# EasyEDA schematic EasyEDA.json
TITLE: KeyThing; REV: 1.0; Date: 2023-04-28; Sheet: 1/1; Drawn By: Greg; Company: COMPAN~1
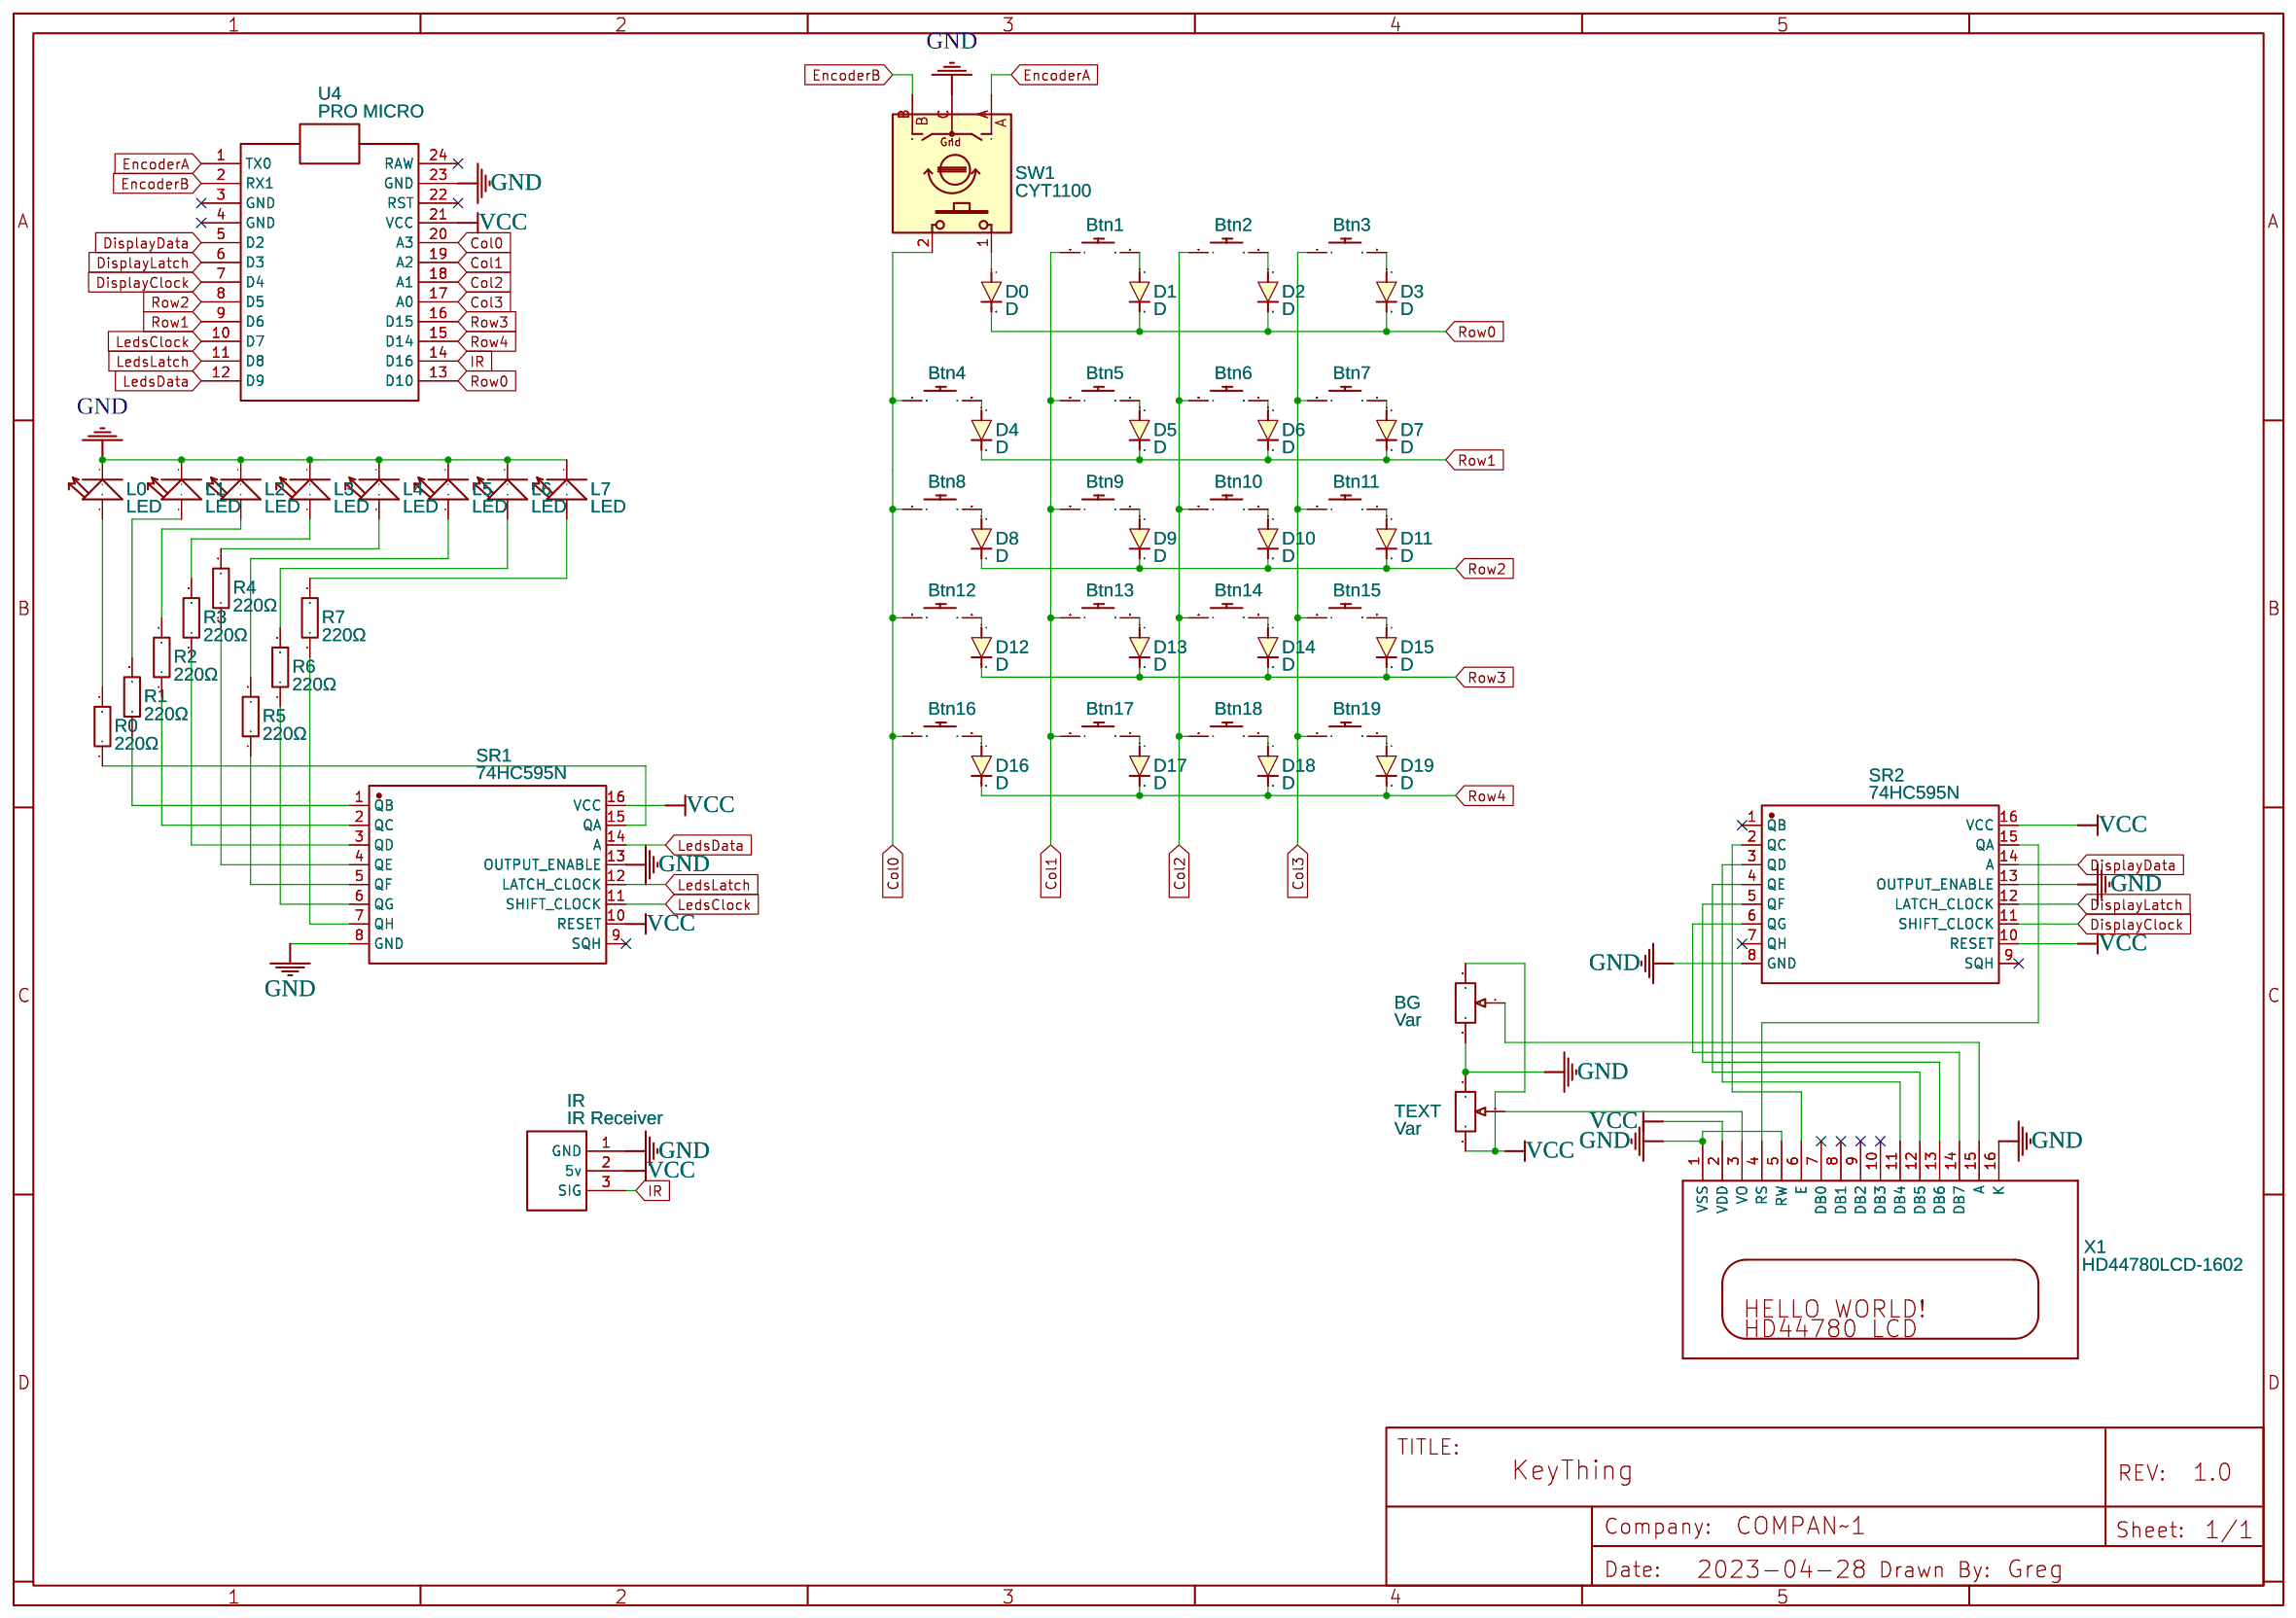
[diagram p0: schematic sheet]

## Parts
B1  Btn1  [CHERRY MX]
B2  Btn2  [CHERRY MX]
B3  Btn3  [CHERRY MX]
B4  Btn4  [CHERRY MX]
B5  Btn5  [CHERRY MX]
B6  Btn6  [CHERRY MX]
B7  Btn7  [CHERRY MX]
B8  Btn8  [CHERRY MX]
B9  Btn9  [CHERRY MX]
B10  Btn10  [CHERRY MX]
B11  Btn11  [CHERRY MX]
B12  Btn12  [CHERRY MX]
B13  Btn13  [CHERRY MX]
B14  Btn14  [CHERRY MX]
B15  Btn15  [CHERRY MX]
B16  Btn16  [CHERRY MX]
B17  Btn17  [CHERRY MX]
B18  Btn18  [CHERRY MX]
B19  Btn19  [CHERRY MX]
BG  Var  [WH148]
D0  D  [DIODE-1N4148]
D1  D  [DIODE-1N4148]
D2  D  [DIODE-1N4148]
D3  D  [DIODE-1N4148]
D4  D  [DIODE-1N4148]
D5  D  [DIODE-1N4148]
D6  D  [DIODE-1N4148]
D7  D  [DIODE-1N4148]
D8  D  [DIODE-1N4148]
D9  D  [DIODE-1N4148]
D10  D  [DIODE-1N4148]
D11  D  [DIODE-1N4148]
D12  D  [DIODE-1N4148]
D13  D  [DIODE-1N4148]
D14  D  [DIODE-1N4148]
D15  D  [DIODE-1N4148]
D16  D  [DIODE-1N4148]
D17  D  [DIODE-1N4148]
D18  D  [DIODE-1N4148]
D19  D  [DIODE-1N4148]
IR  IR Receiver  [IR RECEIVER]
L0  LED  [LED2-2.54-6MM]
L1  LED  [LED2-2.54-6MM]
L2  LED  [LED2-2.54-6MM]
L3  LED  [LED2-2.54-6MM]
L4  LED  [LED2-2.54-6MM]
L5  LED  [LED2-2.54-6MM]
L6  LED  [LED2-2.54-6MM]
L7  LED  [LED2-2.54-6MM]
R0  220Ω  [RES-TH_BD2.3-L3.7-P7.70-D0.9]
R1  220Ω  [RES-TH_BD2.3-L3.7-P7.70-D0.9]
R2  220Ω  [RES-TH_BD2.3-L3.7-P7.70-D0.9]
R3  220Ω  [RES-TH_BD2.3-L3.7-P7.70-D0.9]
R4  220Ω  [RES-TH_BD2.3-L3.7-P7.70-D0.9]
R5  220Ω  [RES-TH_BD2.3-L3.7-P7.70-D0.9]
R6  220Ω  [RES-TH_BD2.3-L3.7-P7.70-D0.9]
R7  220Ω  [RES-TH_BD2.3-L3.7-P7.70-D0.9]
SR1  74HC595N  [DIP-16_L20.0-W6.4-P2.54-LS7.6-BL]
SR2  74HC595N  [DIP-16_L20.0-W6.4-P2.54-LS7.6-BL]
SW1  CYT1100  [SW-TH_PEC11R-4XXXF-SXXXX]
TEXT  Var  [WH148]
U4  PRO MICRO  [ARDUINO-PRO-MICRO]
X1  HD44780LCD-1602  [LCD1602]

## Library data of the parts
B1-B19 = Cherry MX: Contributor: ajfxlvmf; Supplier Part: 264546125050; Supplier: eBay
BG TEXT = R_3386P_EU: Supplier: LCSC; Contributor: LCEDA_Lib; Value(Ω): 10K
D0-D19 = DIODE-1N4148: Contributor: Matías Zapata
IR = IR Receiver: Manufacturer: Youmile; link: https://www.amazon.co.uk/gp/product/B07RFB5KCT/ref=ppx_yo_dt_b_asin_title_o01_s01?ie=UTF8&psc=1; Contributor: booth1833
L0-L7 = 503UOC: DIP LED Transparent-Orange;
R0-R7 = MF1/8W-220Ω±1%-ST52: Supplier: LCSC; Supplier Part: C2848572; Manufacturer: VO(翔胜); link: https://atta.szlcsc.com/upload/public/pdf/source/20200609/C601728_5AA4C0C8E12E11069DA2C3356F29D1F2.pdf; Contributor: lcsc; JLCPCB Part Class: Extended Part
SR1 SR2 = 74HC595N: Supplier: LCSC; Supplier Part: C507175; Manufacturer: HGSEMI(华冠); Contributor: LCSC; JLCPCB Part Class: Extended Part
SW1 = CYT1100: Supplier: LCSC; Supplier Part: C143789; Manufacturer: BOURNS; Manufacturer Part: PEC11R-4015F-S0024; Contributor: zbcbef00; JLCPCB Part Class: Extended Part
U4 = PRO MICRO: Contributor: elcastrol
X1 = HD44780LCD-1602: HD44780 LCD; Contributor: Adafruit

## Nets
GND: BG.3 IR.1(GND) L0.- L1.- L2.- L3.- L4.- L5.- L6.- L7.- SR1.8(GND) SR1.13(OUTPUT_ENABLE) SR2.8(GND) SR2.13(OUTPUT_ENABLE) SW1.C TEXT.1 U4.23(GND) X1.1(VSS) X1.5(RW) X1.16(K)
VCC: BG.1 IR.2(5v) SR1.10(RESET) SR1.16(VCC) SR2.10(RESET) SR2.16(VCC) TEXT.3 U4.21(VCC) X1.2(VDD)
Col0: B4.S1(1) B8.S1(1) B12.S1(1) B16.S1(1) SW1.2 U4.20(A3)
Col1: B1.S1(1) B5.S1(1) B9.S1(1) B13.S1(1) B17.S1(1) U4.19(A2)
Col2: B2.S1(1) B6.S1(1) B10.S1(1) B14.S1(1) B18.S1(1) U4.18(A1)
Col3: B3.S1(1) B7.S1(1) B11.S1(1) B15.S1(1) B19.S1(1) U4.17(A0)
DisplayClock: SR2.11(SHIFT_CLOCK) U4.7(D4)
DisplayData: SR2.14(A) U4.5(D2)
DisplayLatch: SR2.12(LATCH_CLOCK) U4.6(D3)
EncoderA: SW1.A U4.1(TX0)
EncoderB: SW1.B U4.2(RX1)
IR: IR.3(SIG) U4.14(D16)
LedsClock: SR1.11(SHIFT_CLOCK) U4.10(D7)
LedsData: SR1.14(A) U4.12(D9)
LedsLatch: SR1.12(LATCH_CLOCK) U4.11(D8)
Row0: D0.C D1.C D2.C D3.C U4.13(D10)
Row1: D4.C D5.C D6.C D7.C U4.9(D6)
Row2: D8.C D9.C D10.C D11.C U4.8(D5)
Row3: D12.C D13.C D14.C D15.C U4.16(D15)
Row4: D16.C D17.C D18.C D19.C U4.15(D14)
Net-(B1-S2): B1.S2(2) D1.A
Net-(B2-S2): B2.S2(2) D2.A
Net-(B3-S2): B3.S2(2) D3.A
Net-(B4-S2): B4.S2(2) D4.A
Net-(B5-S2): B5.S2(2) D5.A
Net-(B6-S2): B6.S2(2) D6.A
Net-(B7-S2): B7.S2(2) D7.A
Net-(B8-S2): B8.S2(2) D8.A
Net-(B9-S2): B9.S2(2) D9.A
Net-(B10-S2): B10.S2(2) D10.A
Net-(B11-S2): B11.S2(2) D11.A
Net-(B12-S2): B12.S2(2) D12.A
Net-(B13-S2): B13.S2(2) D13.A
Net-(B14-S2): B14.S2(2) D14.A
Net-(B15-S2): B15.S2(2) D15.A
Net-(B16-S2): B16.S2(2) D16.A
Net-(B17-S2): B17.S2(2) D17.A
Net-(B18-S2): B18.S2(2) D18.A
Net-(B19-S2): B19.S2(2) D19.A
Net-(BG-2): BG.2 X1.15(A)
Net-(D0-A): D0.A SW1.1
Net-(L0-+): L0.+ R0.2
Net-(L1-+): L1.+ R1.2
Net-(L2-+): L2.+ R2.2
Net-(L3-+): L3.+ R3.2
Net-(L4-+): L4.+ R4.2
Net-(L5-+): L5.+ R5.2
Net-(L6-+): L6.+ R6.2
Net-(L7-+): L7.+ R7.2
Net-(R0-1): R0.1 SR1.15(QA)
Net-(R1-1): R1.1 SR1.1(QB)
Net-(R2-1): R2.1 SR1.2(QC)
Net-(R3-1): R3.1 SR1.3(QD)
Net-(R4-1): R4.1 SR1.4(QE)
Net-(R5-1): R5.1 SR1.5(QF)
Net-(R6-1): R6.1 SR1.6(QG)
Net-(R7-1): R7.1 SR1.7(QH)
Net-(SR2-2): SR2.2(QC) X1.6(E)
Net-(SR2-3): SR2.3(QD) X1.11(DB4)
Net-(SR2-4): SR2.4(QE) X1.12(DB5)
Net-(SR2-5): SR2.5(QF) X1.13(DB6)
Net-(SR2-6): SR2.6(QG) X1.14(DB7)
Net-(SR2-15): SR2.15(QA) X1.4(RS)
Net-(TEXT-2): TEXT.2 X1.3(VO)

Not connected (* = marked no-connect by the designer): SR1 9(SQH)*; SR2 1(QB)* 7(QH)* 9(SQH)*; U4 3(GND)* 4(GND)* 22(RST)* 24(RAW)*; X1 7(DB0)* 8(DB1)* 9(DB2)* 10(DB3)*
